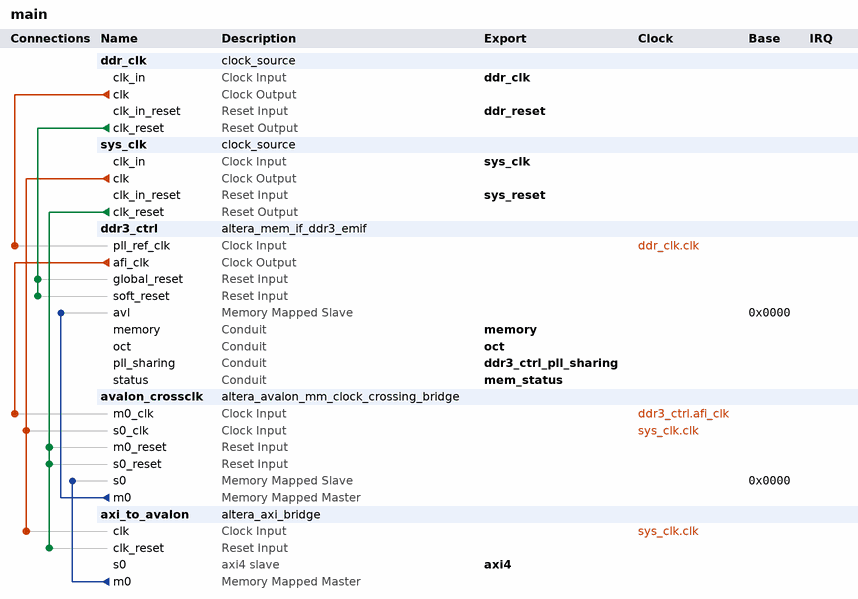
[diagram p0: system contents]
# Platform Designer (Qsys) system main, Cyclone V 5CSXFC6D6F31C6
# Parameters at their usual value, and those the tool derives, are not listed.
package require -exact qsys 20.1
create_system main
set_project_property DEVICE_FAMILY {Cyclone V}
set_project_property DEVICE 5CSXFC6D6F31C6

add_instance ddr_clk clock_source 20.1
set_instance_parameter_value ddr_clk clockFrequency 50000000

add_instance sys_clk clock_source 20.1
set_instance_parameter_value sys_clk clockFrequency 50000000

add_instance ddr3_ctrl altera_mem_if_ddr3_emif 20.1
set_instance_parameter_value ddr3_ctrl AVL_MAX_SIZE 4
set_instance_parameter_value ddr3_ctrl CALIBRATION_MODE Full
set_instance_parameter_value ddr3_ctrl CPORT_TYPE_PORT Bidirectional,Bidirectional,Bidirectional,Bidirectional,Bidirectional,Bidirectional
set_instance_parameter_value ddr3_ctrl EXPORT_AFI_HALF_CLK false
set_instance_parameter_value ddr3_ctrl HARD_EMIF false
set_instance_parameter_value ddr3_ctrl MEM_BANKADDR_WIDTH 3
set_instance_parameter_value ddr3_ctrl MEM_CLK_FREQ 400.0
set_instance_parameter_value ddr3_ctrl MEM_CLK_FREQ_MAX 400.0
set_instance_parameter_value ddr3_ctrl MEM_COL_ADDR_WIDTH 10
set_instance_parameter_value ddr3_ctrl MEM_DQ_WIDTH 32
set_instance_parameter_value ddr3_ctrl MEM_FORMAT DISCRETE
set_instance_parameter_value ddr3_ctrl MEM_ROW_ADDR_WIDTH 15
set_instance_parameter_value ddr3_ctrl MEM_TCL 6
set_instance_parameter_value ddr3_ctrl MEM_TFAW_NS 50.0
set_instance_parameter_value ddr3_ctrl MEM_TRAS_NS 37.5
set_instance_parameter_value ddr3_ctrl MEM_TRCD_NS 15.0
set_instance_parameter_value ddr3_ctrl MEM_TRFC_NS 300.0
set_instance_parameter_value ddr3_ctrl MEM_TRP_NS 15.0
set_instance_parameter_value ddr3_ctrl MEM_TRRD_NS 13.2
set_instance_parameter_value ddr3_ctrl MEM_TRTP_NS 13.2
set_instance_parameter_value ddr3_ctrl MEM_TWTR 4
set_instance_parameter_value ddr3_ctrl MEM_VENDOR JEDEC
set_instance_parameter_value ddr3_ctrl MEM_WTCL 5
set_instance_parameter_value ddr3_ctrl PLL_LOCATION Top_Bottom
set_instance_parameter_value ddr3_ctrl POWER_OF_TWO_BUS false
set_instance_parameter_value ddr3_ctrl PRIORITY_PORT 1,1,1,1,1,1
set_instance_parameter_value ddr3_ctrl RATE Half
set_instance_parameter_value ddr3_ctrl REF_CLK_FREQ 50.0
set_instance_parameter_value ddr3_ctrl SPEED_GRADE 6
set_instance_parameter_value ddr3_ctrl TIMING_BOARD_AC_SKEW 0.03
set_instance_parameter_value ddr3_ctrl TIMING_BOARD_AC_TO_CK_SKEW 0.0
set_instance_parameter_value ddr3_ctrl TIMING_BOARD_DQ_TO_DQS_SKEW 0.0
set_instance_parameter_value ddr3_ctrl TIMING_BOARD_MAX_CK_DELAY 0.03
set_instance_parameter_value ddr3_ctrl TIMING_BOARD_MAX_DQS_DELAY 0.03
set_instance_parameter_value ddr3_ctrl TIMING_BOARD_SKEW_BETWEEN_DQS 0.08
set_instance_parameter_value ddr3_ctrl TIMING_BOARD_SKEW_CKDQS_DIMM_MAX 0.0
set_instance_parameter_value ddr3_ctrl TIMING_BOARD_SKEW_CKDQS_DIMM_MIN 0.0
set_instance_parameter_value ddr3_ctrl TIMING_BOARD_SKEW_WITHIN_DQS 0.01
set_instance_parameter_value ddr3_ctrl TIMING_TDH 150
set_instance_parameter_value ddr3_ctrl TIMING_TDQSCK 400
set_instance_parameter_value ddr3_ctrl TIMING_TDQSQ 200
set_instance_parameter_value ddr3_ctrl TIMING_TDQSS 0.25
set_instance_parameter_value ddr3_ctrl TIMING_TDS 75
set_instance_parameter_value ddr3_ctrl TIMING_TDSH 0.2
set_instance_parameter_value ddr3_ctrl TIMING_TDSS 0.2
set_instance_parameter_value ddr3_ctrl TIMING_TIH 275
set_instance_parameter_value ddr3_ctrl TIMING_TIS 200
set_instance_parameter_value ddr3_ctrl TIMING_TQSH 0.38
set_instance_parameter_value ddr3_ctrl USER_DEBUG_LEVEL 1

add_instance avalon_crossclk altera_avalon_mm_clock_crossing_bridge 20.1
set_instance_parameter_value avalon_crossclk ADDRESS_WIDTH 30
set_instance_parameter_value avalon_crossclk COMMAND_FIFO_DEPTH 4
set_instance_parameter_value avalon_crossclk DATA_WIDTH 32
set_instance_parameter_value avalon_crossclk MASTER_SYNC_DEPTH 2
set_instance_parameter_value avalon_crossclk MAX_BURST_SIZE 1
set_instance_parameter_value avalon_crossclk RESPONSE_FIFO_DEPTH 4
set_instance_parameter_value avalon_crossclk SLAVE_SYNC_DEPTH 2
set_instance_parameter_value avalon_crossclk USE_AUTO_ADDRESS_WIDTH 0

add_instance axi_to_avalon altera_axi_bridge 20.1
set_instance_parameter_value axi_to_avalon ADDR_WIDTH 30
set_instance_parameter_value axi_to_avalon AXI_VERSION AXI4
set_instance_parameter_value axi_to_avalon COMBINED_ACCEPTANCE_CAPABILITY 16
set_instance_parameter_value axi_to_avalon COMBINED_ISSUING_CAPABILITY 16
set_instance_parameter_value axi_to_avalon DATA_WIDTH 32
set_instance_parameter_value axi_to_avalon M0_ID_WIDTH 4
set_instance_parameter_value axi_to_avalon READ_ACCEPTANCE_CAPABILITY 16
set_instance_parameter_value axi_to_avalon READ_ADDR_USER_WIDTH 32
set_instance_parameter_value axi_to_avalon READ_DATA_REORDERING_DEPTH 1
set_instance_parameter_value axi_to_avalon READ_DATA_USER_WIDTH 32
set_instance_parameter_value axi_to_avalon READ_ISSUING_CAPABILITY 16
set_instance_parameter_value axi_to_avalon S0_ID_WIDTH 4
set_instance_parameter_value axi_to_avalon USE_M0_ARBURST 1
set_instance_parameter_value axi_to_avalon USE_M0_ARCACHE 1
set_instance_parameter_value axi_to_avalon USE_M0_ARID 1
set_instance_parameter_value axi_to_avalon USE_M0_ARLEN 1
set_instance_parameter_value axi_to_avalon USE_M0_ARLOCK 1
set_instance_parameter_value axi_to_avalon USE_M0_ARQOS 1
set_instance_parameter_value axi_to_avalon USE_M0_ARREGION 0
set_instance_parameter_value axi_to_avalon USE_M0_ARSIZE 1
set_instance_parameter_value axi_to_avalon USE_M0_ARUSER 0
set_instance_parameter_value axi_to_avalon USE_M0_AWBURST 1
set_instance_parameter_value axi_to_avalon USE_M0_AWCACHE 1
set_instance_parameter_value axi_to_avalon USE_M0_AWID 1
set_instance_parameter_value axi_to_avalon USE_M0_AWLEN 1
set_instance_parameter_value axi_to_avalon USE_M0_AWLOCK 1
set_instance_parameter_value axi_to_avalon USE_M0_AWQOS 1
set_instance_parameter_value axi_to_avalon USE_M0_AWREGION 0
set_instance_parameter_value axi_to_avalon USE_M0_AWSIZE 1
set_instance_parameter_value axi_to_avalon USE_M0_AWUSER 0
set_instance_parameter_value axi_to_avalon USE_M0_BID 1
set_instance_parameter_value axi_to_avalon USE_M0_BRESP 1
set_instance_parameter_value axi_to_avalon USE_M0_BUSER 0
set_instance_parameter_value axi_to_avalon USE_M0_RID 1
set_instance_parameter_value axi_to_avalon USE_M0_RLAST 1
set_instance_parameter_value axi_to_avalon USE_M0_RRESP 1
set_instance_parameter_value axi_to_avalon USE_M0_RUSER 0
set_instance_parameter_value axi_to_avalon USE_M0_WSTRB 1
set_instance_parameter_value axi_to_avalon USE_M0_WUSER 0
set_instance_parameter_value axi_to_avalon USE_PIPELINE 1
set_instance_parameter_value axi_to_avalon USE_S0_ARCACHE 1
set_instance_parameter_value axi_to_avalon USE_S0_ARLOCK 1
set_instance_parameter_value axi_to_avalon USE_S0_ARPROT 1
set_instance_parameter_value axi_to_avalon USE_S0_ARQOS 1
set_instance_parameter_value axi_to_avalon USE_S0_ARREGION 0
set_instance_parameter_value axi_to_avalon USE_S0_ARUSER 0
set_instance_parameter_value axi_to_avalon USE_S0_AWCACHE 1
set_instance_parameter_value axi_to_avalon USE_S0_AWLOCK 1
set_instance_parameter_value axi_to_avalon USE_S0_AWPROT 1
set_instance_parameter_value axi_to_avalon USE_S0_AWQOS 1
set_instance_parameter_value axi_to_avalon USE_S0_AWREGION 0
set_instance_parameter_value axi_to_avalon USE_S0_AWUSER 0
set_instance_parameter_value axi_to_avalon USE_S0_BRESP 1
set_instance_parameter_value axi_to_avalon USE_S0_BUSER 0
set_instance_parameter_value axi_to_avalon USE_S0_RRESP 1
set_instance_parameter_value axi_to_avalon USE_S0_RUSER 0
set_instance_parameter_value axi_to_avalon USE_S0_WLAST 1
set_instance_parameter_value axi_to_avalon USE_S0_WUSER 0
set_instance_parameter_value axi_to_avalon WRITE_ACCEPTANCE_CAPABILITY 16
set_instance_parameter_value axi_to_avalon WRITE_ADDR_USER_WIDTH 32
set_instance_parameter_value axi_to_avalon WRITE_DATA_USER_WIDTH 32
set_instance_parameter_value axi_to_avalon WRITE_ISSUING_CAPABILITY 16
set_instance_parameter_value axi_to_avalon WRITE_RESP_USER_WIDTH 32

# connections
add_connection ddr3_ctrl.afi_clk avalon_crossclk.m0_clk clock
add_connection ddr_clk.clk ddr3_ctrl.pll_ref_clk clock
add_connection sys_clk.clk avalon_crossclk.s0_clk clock
add_connection sys_clk.clk axi_to_avalon.clk clock
add_connection ddr_clk.clk_reset ddr3_ctrl.global_reset reset
add_connection ddr_clk.clk_reset ddr3_ctrl.soft_reset reset
add_connection sys_clk.clk_reset avalon_crossclk.m0_reset reset
add_connection sys_clk.clk_reset avalon_crossclk.s0_reset reset
add_connection sys_clk.clk_reset axi_to_avalon.clk_reset reset
add_connection avalon_crossclk.m0 ddr3_ctrl.avl avalon
set_connection_parameter_value avalon_crossclk.m0/ddr3_ctrl.avl baseAddress 0x0000
add_connection axi_to_avalon.m0 avalon_crossclk.s0 avalon
set_connection_parameter_value axi_to_avalon.m0/avalon_crossclk.s0 baseAddress 0x0000

# exported interfaces
add_interface axi4 axi4 slave
set_interface_property axi4 EXPORT_OF axi_to_avalon.s0
add_interface ddr3_ctrl_pll_sharing conduit end
set_interface_property ddr3_ctrl_pll_sharing EXPORT_OF ddr3_ctrl.pll_sharing
add_interface ddr_clk clock sink
set_interface_property ddr_clk EXPORT_OF ddr_clk.clk_in
add_interface ddr_reset reset sink
set_interface_property ddr_reset EXPORT_OF ddr_clk.clk_in_reset
add_interface mem_status conduit end
set_interface_property mem_status EXPORT_OF ddr3_ctrl.status
add_interface memory conduit end
set_interface_property memory EXPORT_OF ddr3_ctrl.memory
add_interface oct conduit end
set_interface_property oct EXPORT_OF ddr3_ctrl.oct
add_interface sys_clk clock sink
set_interface_property sys_clk EXPORT_OF sys_clk.clk_in
add_interface sys_reset reset sink
set_interface_property sys_reset EXPORT_OF sys_clk.clk_in_reset

set_interconnect_requirement {$system} qsys_mm.clockCrossingAdapter HANDSHAKE
set_interconnect_requirement {$system} qsys_mm.enableEccProtection FALSE
set_interconnect_requirement {$system} qsys_mm.insertDefaultSlave FALSE
set_interconnect_requirement {$system} qsys_mm.maxAdditionalLatency 1

save_system main.qsys
